# Altium schematic sheet Power_test.SchDoc
size A3; SheetNumber: 2; SheetTotal: 5
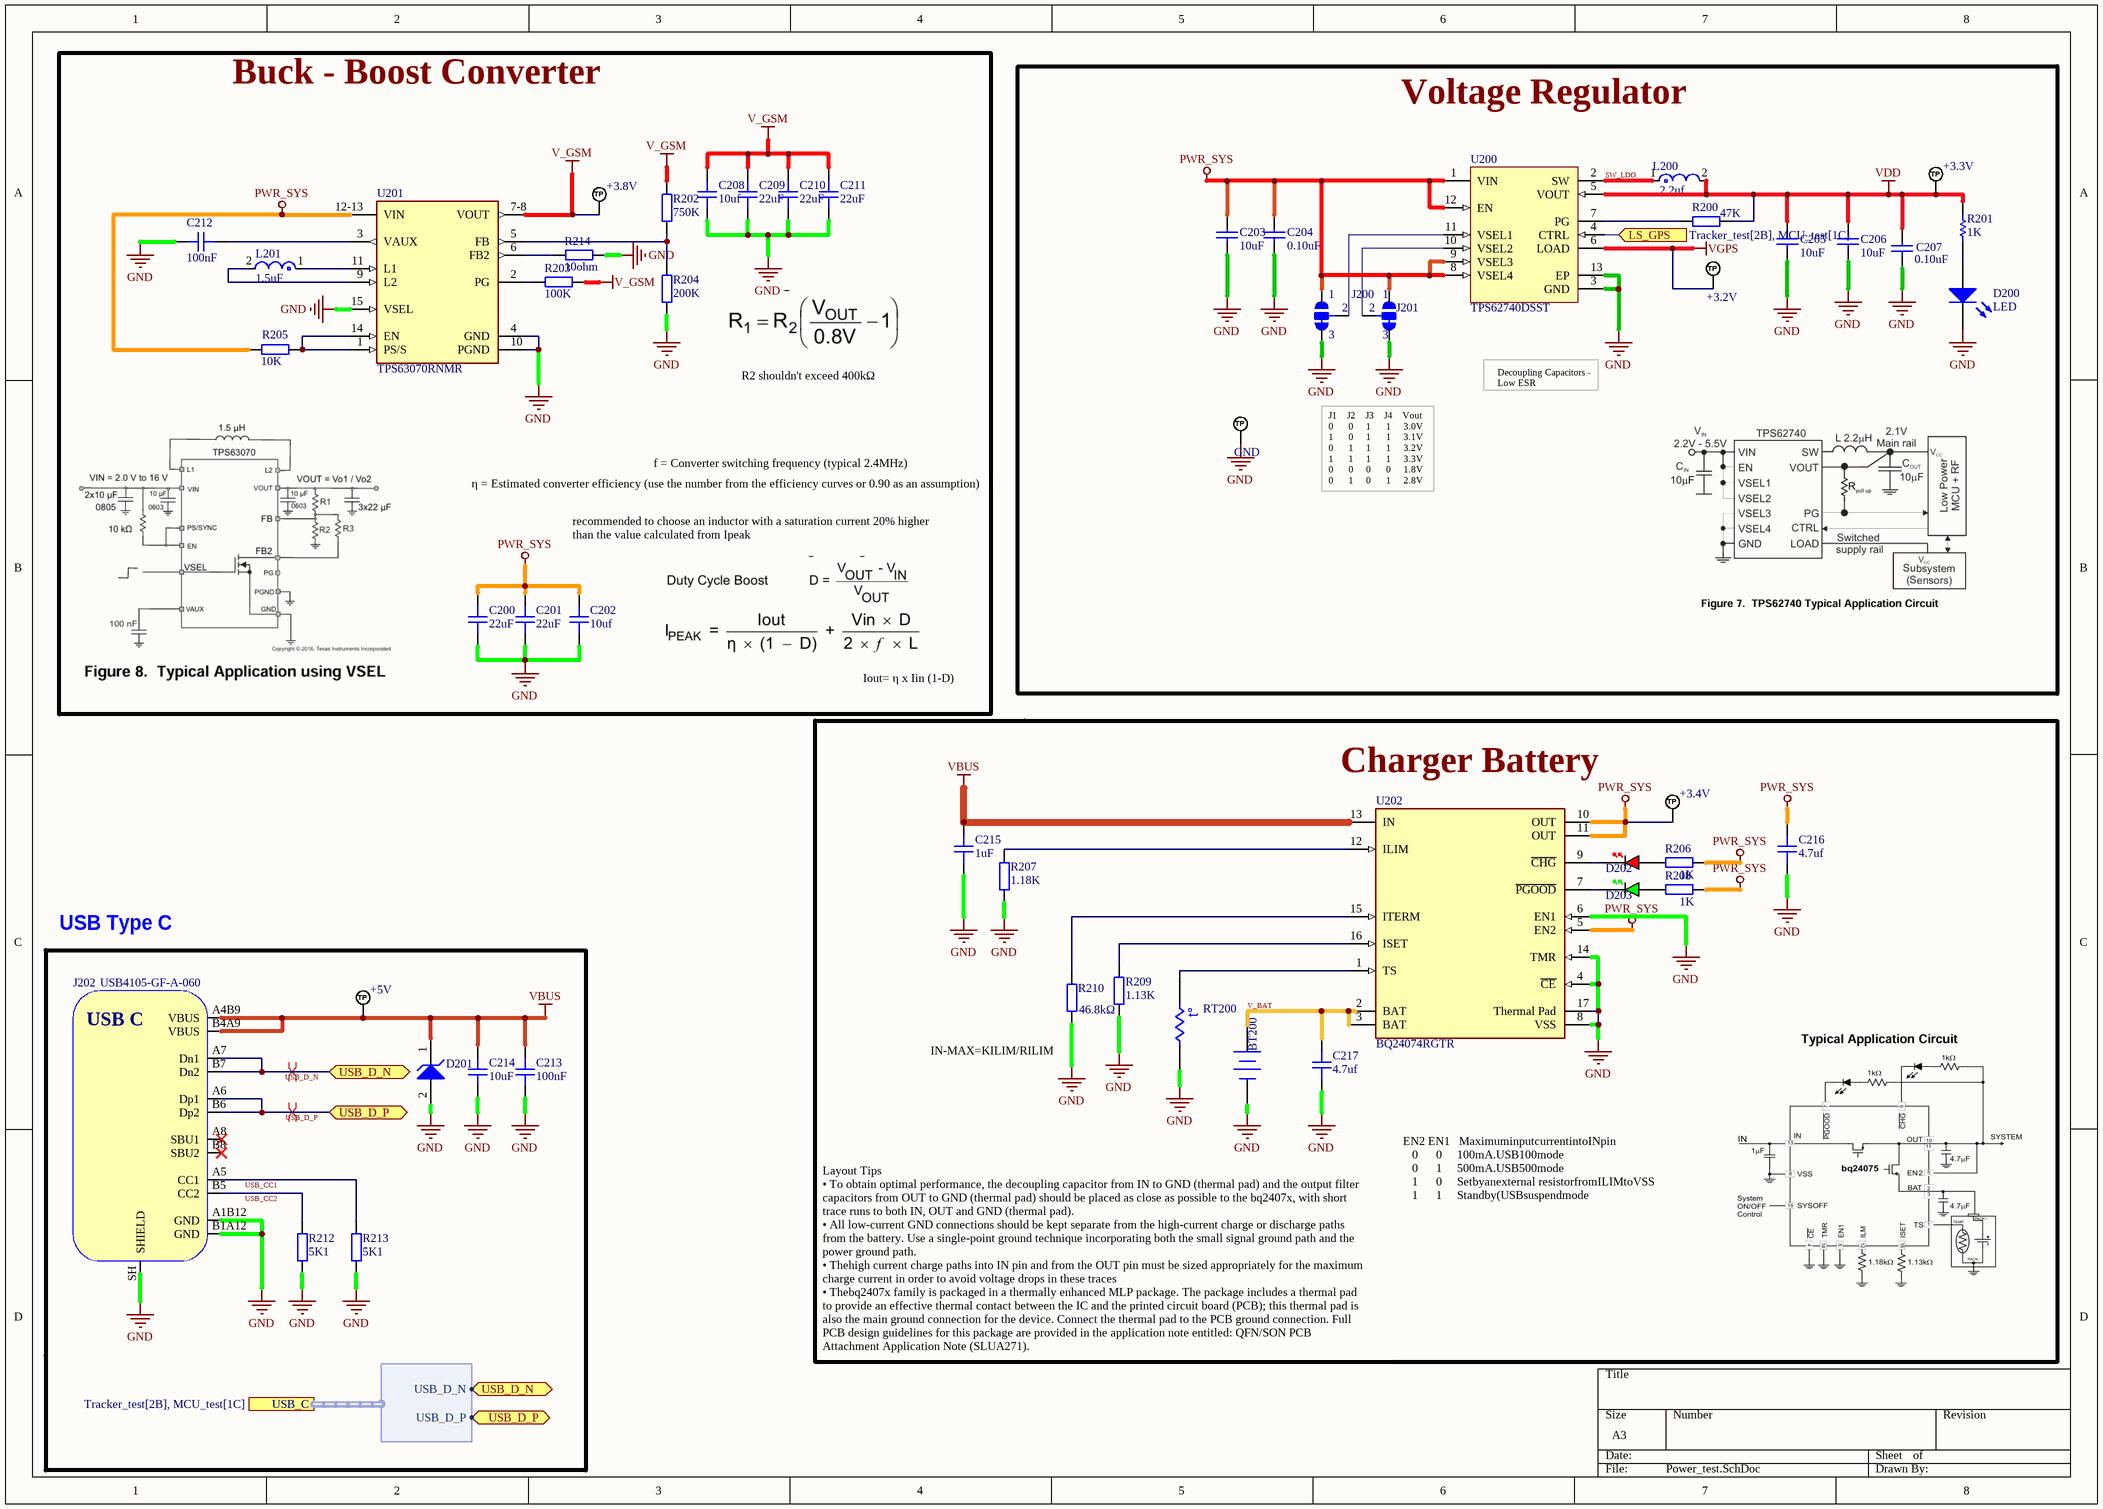
[diagram p0: Power_test.SchDoc]

## Parts
+3.2V  TP_NOBOM  [PAD_RND_1MM]  (value not drawn)  (no BOM)
+3.3V  TP_NOBOM  [PAD_RND_1MM]  (value not drawn)  (no BOM)
+3.4V  TP_NOBOM  [PAD_RND_1MM]  (value not drawn)  (no BOM)
+3.8V  TP_NOBOM  [PAD_RND_1MM]  (value not drawn)  (no BOM)
+5V  TP_NOBOM  [PAD_RND_1MM]  (value not drawn)  (no BOM)
BT200  Battery  [BAT-2]  (value not drawn)
C200  22uF  [CAP_0805]
C201  22uF  [CAP_0805]
C202  10uf  [CAP_0603]
C203  value 10uF  [C0402 - duplicate]  (hidden comment: CAP)
C204  value 0.10uF  [C0402]  (hidden comment: 0.1uf)
C205  value 10uF  [C0402 - duplicate]  (hidden comment: CAP)
C206  value 10uF  [C0402 - duplicate]  (hidden comment: CAP)
C207  value 0.10uF  [C0402]  (hidden comment: 0.1uf)
C208  10uf  [CAP_0603]
C209  22uF  [CAP_0805]
C210  22uF  [CAP_0805]
C211  22uF  [CAP_0805]
C212  100nF  [CAP_0603]
C213  100nF  [CAP_0402]
C214  10uF  [CAP_0402]
C215  1uF  [CAP_0402]
C216  4.7uf  [CAP_0402]
C217  4.7uf  [CAP_0402]
D200  LED  [LED-0603-R]
D201  SZSMF6.0AT1G  [ONSC-SOD-123FL-2-498_V]  (value not drawn)
D202  RED  [LED_0402_RED]  (value not drawn)
D203  GREEN  [LED_0402_GREEN]  (value not drawn)
GND  TP_NOBOM  [PAD_RND_1MM]  (value not drawn)  (no BOM)
J200  JUMPER-3-PAD  [JUMPER-3-NC]  (value not drawn)
J201  JUMPER-3-PAD  [JUMPER-3-NC]  (value not drawn)
J202  USB4105-GF-A-060  [USB4105-GF-A-060]
L200  2.2uf  [FP-LPS3314-MFG]
L201  1.5uF  [FP-XFL4020-MFG]
R200  47K  [RES_0402]
R201  1K  [R0402]
R202  750K  [RES_0402]
R203  100K  [RES_0402]
R204  200K  [RES_0402]
R205  10K  [RES_0402]
R206  1K  [RES_0402]
R207  1.18K  [RES_0402]
R208  1K  [RES_0402]
R209  1.13K  [RES_0402]
R210  46.8kΩ  [RES_0402]
R212  5K1  [RES_0603]
R213  5K1  [RES_0603]
R214  10ohm  [RES_0402]
RT200  Res Thermal  [6-0805_N]  (value not drawn)
U200  TPS62740DSST  [DSS0012A_V]
U201  TPS63070RNMR  [FP-RNM0015A-MFG]
U202  BQ24074RGTR  [FP-RGT0016C-MFG]

## Blocks framed on the sheet
Buck - Boost Converter: +3.8V C200-C202 C208-C212 L201 R202-R205 R214 U201
Voltage Regulator: +3.2V +3.3V C203-C207 D200 GND J200 J201 L200 R200 R201 U200
Charger Battery: +3.4V BT200 C215-C217 D202 D203 R206-R210 RT200 U202
USB Type C: +5V C213 C214 D201 J202 R212 R213

## Ports
LS_GPS (in, see Tracker_test[2B], MCU_test[1C]), USB_C (harness USB_C, see Tracker_test[2B], MCU_test[1C]), USB_D_N (bidir), USB_D_P (bidir)

## Harnesses
USB_C: USB_D_N, USB_D_P

## Nets
GND: BT200.2(-) C200.1 C201.1 C202.1 C203.2 C204.2 C205.2 C206.2 C207.2 C208.1 C209.1 C210.1 C211.1 C212.1 C213.1 C214.1 C215.1 C216.2 C217.2 D200.2(K) D201.2(A) GND.1(TP) J200.3 J201.3 J202.A1B12(GND) J202.B1A12(GND) J202.SH(SHIELD) R204.1 R207.1 R209.1 R210.2 R212.1 R213.1 R214.1 RT200.2 U200.3(GND) U200.13(EP) U201.4(GND) U201.10(PGND) U201.15(VSEL) U202.4(~{CE}) U202.6(EN1) U202.8(VSS) U202.14(TMR) U202.17(Thermal_Pad)
PWR_SYS: +3.4V.1(TP) C200.2 C201.2 C202.2 C203.1 C204.1 C216.1 J200.1 J201.1 R205.1 R206.2 R208.2 U200.1(VIN) U200.8(VSEL4) U200.9(VSEL3) U200.12(EN) U201.12-13(VIN) U202.5(EN2) U202.10(OUT) U202.11(OUT)
V_GSM: +3.8V.1(TP) C208.2 C209.2 C210.2 C211.2 R202.2 R203.1 U201.7-8(VOUT)
VBUS: +5V.1(TP) C213.2 C214.2 C215.2 D201.1(K) J202.A4B9(VBUS) J202.B4A9(VBUS) U202.13(IN)
VDD: +3.3V.1(TP) C205.1 C206.1 C207.1 L200.2 R200.2 R201.1 U200.5(VOUT)
VGPS: +3.2V.1(TP) U200.6(LOAD)
LS_GPS: U200.4(CTRL) ; port LS_GPS
SW_LDO: L200.1 U200.2(SW)
USB_CC1: J202.A5(CC1) R213.2
USB_CC2: J202.B5(CC2) R212.2
USB_D_N: J202.A7(Dn1) J202.B7(Dn2) ; port USB_D_N, port USB_C.USB_D_N
USB_D_P: J202.A6(Dp1) J202.B6(Dp2) ; port USB_D_P, port USB_C.USB_D_P
V_BAT: BT200.1(+) C217.1 U202.2(BAT) U202.3(BAT)
NetC212_2: C212.2 U201.3(VAUX)
NetD200_1: D200.1(A) R201.2
NetD202_A: D202.A R206.1
NetD202_K: D202.K U202.9(~{CHG})
NetD203_A: D203.A R208.1
NetD203_K: D203.K U202.7(~{PGOOD})
NetJ200_2: J200.2 U200.11(VSEL1)
NetJ201_2: J201.2 U200.10(VSEL2)
NetL201_1: L201.1 U201.11(L1)
NetL201_2: L201.2 U201.9(L2)
NetR200_1: R200.1 U200.7(PG)
NetR202_1: R202.1 R204.2 U201.5(FB)
NetR203_2: R203.2 U201.2(PG)
NetR205_2: R205.2 U201.1(PS/S) U201.14(EN)
NetR207_2: R207.2 U202.12(ILIM)
NetR209_2: R209.2 U202.16(ISET)
NetR210_1: R210.1 U202.15(ITERM)
NetR214_2: R214.2 U201.6(FB2)
NetRT200_1: RT200.1 U202.1(TS)

Not connected (* = marked no-connect by the designer): J202 A8(SBU1)* B8(SBU2)*

## Layout directives
differential pair; differential pair class USB: USB_D_N, USB_D_P

## Notes on the sheet
- R2 shouldn't exceed 400kΩ
- Decoupling Capacitors - Low ESR
- η = Estimated converter efficiency (use the number from the efficiency curves or 0.90 as an assumption)
- f = Converter switching frequency (typical 2.4MHz)
- J1    J2    J3    J4    Vout
  0      0     1      1     3.0V
  1      0     1      1     3.1V
  0      1     1      1     3.2V
  1      1     1      1     3.3V
  0      0     0      0     1.8V
  0      1     0      1     2.8V
- recommended to choose an inductor with a saturation current 20% higher
  than the value calculated from Ipeak
- Iout= η x Iin (1-D)
- (near R210) IN-MAX=KILIM/RILIM
- EN2 EN1   MaximuminputcurrentintoINpin
  0      0     100mA.USB100mode
  0      1     500mA.USB500mode
  1      0     Setbyanexternal resistorfromILIMtoVSS
  1      1     Standby(USBsuspendmode
- Layout Tips
  • To obtain optimal performance, the decoupling capacitor from IN to GND (thermal pad) and the output filter
  capacitors from OUT to GND (thermal pad) should be placed as close as possible to the bq2407x, with short
  trace runs to both IN, OUT and GND (thermal pad).
  • All low-current GND connections should be kept separate from the high-current charge or discharge paths
  from the battery. Use a single-point ground technique incorporating both the small signal ground path and the
  power ground path.
  • Thehigh current charge paths into IN pin and from the OUT pin must be sized appropriately for the maximum
  charge current in order to avoid voltage drops in these traces
  • Thebq2407x family is packaged in a thermally enhanced MLP package. The package includes a thermal pad
  to provide an effective thermal contact between the IC and the printed circuit board (PCB); this thermal pad is
  also the main ground connection for the device. Connect the thermal pad to the PCB ground connection. Full
  PCB design guidelines for this package are provided in the application note entitled: QFN/SON PCB
  Attachment Application Note (SLUA271).
- (in symbol Res Thermal) t°
- (in symbol USB4105-GF-A-060) USB C

## Library data of the parts
+3.2V +3.3V +3.4V +3.8V +5V GND = TEST_POINT_RND_1MM: Test Point Round 1mm (NO BOM)
BT200 = Battery: Multicell Battery; Published: 24-Mar-1999; LatestRevisionDate: 17-Jul-2002; LatestRevisionNote: Re-released for DXP Platform.; PackageReference: BAT-2; Publisher: Altium Limited; PackageDescription: Battery; 2 Leads
C200 C201 C209-C211 = CAP_0805: Capacitor SMD 0805; Manufacturer: *; Manufacturer Part Number: *; Distributor Link: *; LCSC: *; Rating: *; Dielectric: *
C202 C208 C212 = CAP_0603: Capacitor SMD 0603; Manufacturer: *; Manufacturer Part Number: *; Distributor Link: *; LCSC: *; Rating: *; Dielectric: *
C203 C205 C206 = CAP: CAP CER 10UF 10V X5R 0402; Part Number: C00062; Manufacturer: KEMET - Electronic Component; Manufacturer Part Number: C0603C104K8RACTU; Tolerance: ±10%; Temperature Coefficient: X7R; Supplier 1: Digi-Key; Supplier Part Number 1: 399-1095-2-ND; HelpURL: http://www.kemet.com/Lists/ProductCatalog/Attachments/53/KEM_C1002_X7R_SMD.pdf; Operating Temperature: -55°C ~ 125°C; Type: CER; Voltage: 10V
C204 C207 = CAP_2: CAP CER 0.1UF 10V X5R 0402; Part Number: C00062; Manufacturer: KEMET - Electronic Component; Manufacturer Part Number: C0603C104K8RACTU; Tolerance: ±10%; Temperature Coefficient: X7R; Supplier 1: Digi-Key; Supplier Part Number 1: 399-1095-2-ND; HelpURL: http://www.kemet.com/Lists/ProductCatalog/Attachments/53/KEM_C1002_X7R_SMD.pdf; Operating Temperature: -55°C ~ 125°C; Type: CER; Voltage: 10V
C213-C217 = CAP_0402: Capacitor SMD 0402; Manufacturer: *; Manufacturer Part Number: *; Distributor Link: *; LCSC: *; Rating: *; Dielectric: *
D200 = LED: Typical RED GaAs LED; pin to pad: 1>A 2>K; Manufacturer: Lite-On Inc.; PartNumber: LTST-C190GKT; Published: 8-Jun-2000; LatestRevisionDate: 2016-10-04; LatestRevisionNote: Mech Layer 1 removed.; PackageReference: LED-1; Publisher: Walid Balid; PackageDescription: LED; 2 Leads; ComponentLink1Description: Datasheet link; ComponentLink1URL: http://media.digikey.com/pdf/Data%20Sheets/Lite-On%20PDFs/LTST-C190GKT.pdf; RoHS: Y; Supplier 1: Digi-Key; Supplier Part Number 1: 160-1183-1-ND
D201 = CMP-1061-00610-1: 200 W Transient Voltage Suppressor, 2-Pin SOD-123FL, Pb-Free, Tape and Reel; Manufacturer: On Semiconductor; Direction: Unidirectional; V(BR) Typ (V): 7.02; IR Max (uA): 400; PackageReference: SOD-123FL-2-498; ComponentLink1URL: http://www.onsemi.com/; RoHS: Pb-Free; ComponentLink2Description: Datasheet; PackageDescription: 2-Pin SOD, Body 1.65 x 2.7 mm; PackageVersion: Rev. D, 05/2013; ComponentLink3URL: http://www.onsemi.com/pub_link/Collateral/498-01.PDF; PartNumber: SZSMF6.0AT1G; Mounting Technology: Surface Mount; ComponentLink3Description: Package Specification; ComponentLink1Description: Manufacturer URL; DatasheetVersion: Rev. 7; ComponentLink2URL: http://www.onsemi.com/pub_link/Collateral/SMF5.0AT1-D.PDF; Packing: Tape and Reel
D202 = LED_0402_RED: LED 0402 RED SMD
D203 = LED_0402_GREEN: LED 0402 GREEN SMD
J202 = USB4105-GF-A-060: USB Connector Type C SMT 12 Pin; Manufacturer: GCT; Manufacturer Part Number: USB4105-GF-A-060; Distributor Link: https://eu.mouser.com/ProductDetail/GCT/USB4105-GF-A-060?qs=QNEnbhJQKvY2mocwNJzgfA%3D%3D
L200 = CMP-11268-000121-1: Fixed Inductors 82uH Shld 20% 260mA 2 Ohms LPS3314-823MRC    Inductor, Multilayer, Ceramic, 2.2uH, 0.7A, 0.23 ohm, SMD
L201 = CMP-11268-000104-1: Inductor Power Shielded Wirewound 1.5uH 20% 100KHz 9.1A 15.8mOhm DCR 1515 Automotive Embossed Plastic T/R     XFL4020-152MEC; Core Material: Composite; DC Resistance (DCR): 15.8mR; Saturation Current: 4.1A; Self Resonant Frequency: 59MHz; Tolerance: 20%; Inductance: 1.5uH; Max DC Current: 9.1A; RoHS Compliant: Yes; Max Operating Temperature: 125°C; Length: 4.3mm; Case/Package: SMD/SMT; Mount: Surface Mount; Shielding: Shielded; Min Operating Temperature: -40°C; RMS Current (Irms): 9.1A; Test Frequency: 100kHz; Inductance Tolerance: 20%; REACH SVHC: No SVHC; Packaging: Tape and Reel; Termination: SMD/SMT; Lead Free: Contains Lead; Width: 4.3mm; Series: XFL4020; Height: 2.1mm
R200 R202-R210 R214 = RES_0402: Resistor SMD 0402; Manufacturer: *; Manufacturer Part Number: *; Distributor Link: *; LCSC: *
R201 = RES: RES SMD 1K OHM 5% 1/16W 0402; Part Number: R00007; Manufacturer: Yageo; Manufacturer Part Number: RC0603FR-0715RL; Power: 1/10W; Temperature Coefficient: ±100ppm/°C; Value: 2M37; Tolerance: ±1%; Supplier 1: Digi-Key; Supplier Part Number 1: 311-15.0HRCT-ND; HelpURL: http://www.yageo.com/NewPortal/yageodocoutput?fileName=/pdf/R-Chip/PYu-RC_Group_51_RoHS_L_3.pdf; Operating Temperature: -55°C ~ 155°C
R212 R213 = RES_0603: Resistor SMD 0603; Manufacturer: *; Manufacturer Part Number: *; Distributor Link: *; LCSC: *
RT200 = Res Thermal: Thermistor; Published: 24-Mar-1999; LatestRevisionDate: 29-May-2009; LatestRevisionNote: IPC-7351 Footprint Added.; PackageVersion: Mar-2003; PackageReference: 6-0805; Publisher: Altium Limited; PackageDescription: Chip Resistor 0805 Case Size; Code_IPC: RESC2012
U200 = CMP-0323-00573-2: Step Down Converter For Low Power Applications, 2.2 to 5.5 V VIN, -40 to 85 degC, 12-Pin WSON (DSS), RoHS, Tape and Reel; VIN Min: 2.2 V; VOUT Max: 3.3 V; VOUT Min: 1.8 V; VIN Max: 5.5 V; PackageVersion: 4209244/C, 07/2011; ComponentLink1URL: http://www.ti.com/; Packing: Tape and Reel; PartNumber: TPS62740; ComponentLink2URL: http://www.ti.com/lit/ds/symlink/tps62740.pdf; RoHS: TRUE; ComponentLink3Description: Package Specification; Temperature Min: -40 degC; ComponentLink1Description: Manufacturer URL; PackageReference: DSS0012A; ComponentLink2Description: Datasheet; DatasheetVersion: SLVSB02B; Temperature Max: 85 degC; ComponentLink3URL: http://www.ti.com/litv/pdf/mpds336b; PackageDescription: 12-Pin Plastic Small Outline, Body 3 x 2 mm, Pitch 0.5 mm; Mounting Technology: Surface Mount
U201 = CMP-04918-000409-1: IC REG BCK BST ADJ 3.6A 15VQFN; Synchronous Rectifier: Yes; Output Type: Adjustable; Output Current: 2A; Max Input Voltage: 16V; Switching Frequency: 2.4MHz; Min Output Voltage: 2.5V; Output Configuration: Positive; Min Input Voltage: 2V; Topology: Buck-Boost; Number of Outputs: 1; Max Output Voltage: 9V; Quiescent Current: 50uA; Max Operating Temperature: 125°C; Case/Package: VQFN; Number of Pins: 15; RoHS Compliant: Yes; Mount: Surface Mount; Min Operating Temperature: -40°C; Lead Free: Lead Free; Packaging: Tape and Reel
U202 = CMP-0321-00220-3: IC LI-ION CHARGE MGMT 16-QFN; Fault Protection: Over Voltage; Max Charge Current: 1.5A; Interface: USB; Max Supply Voltage: 10.2V; Number of Cells: 1; Battery Pack Voltage: 4.2V; Min Supply Voltage: 4.35V; Battery Chemistry: LITHIUM-ION; Min Input Voltage: 4.3V; Lead Free: Lead Free; Max Operating Temperature: 125°C; RoHS Compliant: Yes; Contact Plating: Gold; Min Operating Temperature: -40°C; Weight: 0.000808oz; Package Quantity: 3000; Radiation Hardening: No; Case/Package: VQFN; Output Voltage: 4.2V; Packaging: Tape and Reel; Series: -; Output Current: 1.5A; Number of Pins: 16
J200 J201 = JUMPER-3-PAD: Value: JUMPER-3-PAD